# Altium project DSOBoard.PrjPcb
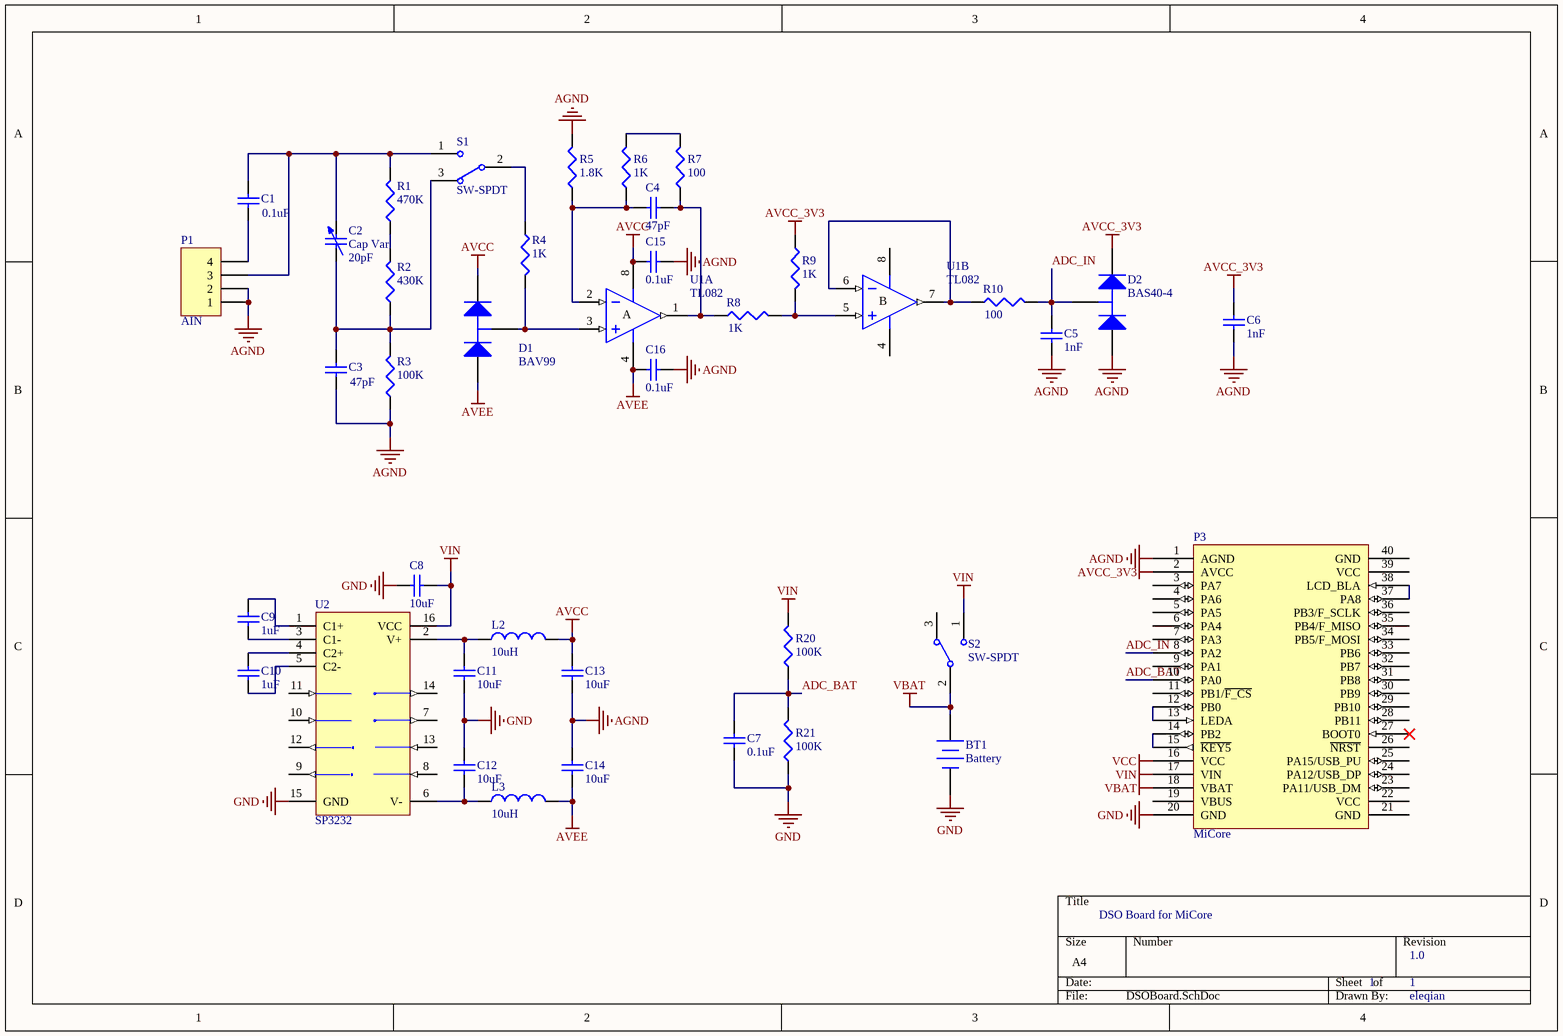
[diagram p0: DSOBoard.SchDoc]
1 sheet, 39 parts. Net scope: global (net labels, ports and power ports of the same name join across sheets).
Board file: DSOBoard.PcbDoc

## Sheet DSOBoard.SchDoc: DSO Board for MiCore
size A4; DrawnBy: eleqian; Revision: 1.0; SheetNumber: 1; SheetTotal: 1

### Parts
BT1  Battery  [BAT-2]
C1  value 0.1uF  [0805C]  (hidden comment: Cap)
C2  Cap Var  value 20pF  [C1210_N]
C3  value 47pF  [0603C]  (hidden comment: Cap)
C4  value 47pF  [0603C]  (hidden comment: Cap)
C5  value 1nF  [0603C]  (hidden comment: Cap)
C6  value 1nF  [0603C]  (hidden comment: Cap)
C7  value 0.1uF  [0603C]  (hidden comment: Cap)
C8  value 10uF  [0603C]  (hidden comment: Cap)
C9  value 1uF  [0603C]  (hidden comment: Cap)
C10  value 1uF  [0603C]  (hidden comment: Cap)
C11  value 10uF  [0603C]  (hidden comment: Cap)
C12  value 10uF  [0603C]  (hidden comment: Cap)
C13  value 10uF  [0603C]  (hidden comment: Cap)
C14  value 10uF  [0603C]  (hidden comment: Cap)
C15  value 0.1uF  [0603C]  (hidden comment: Cap)
C16  value 0.1uF  [0603C]  (hidden comment: Cap)
D1  BAV99  [SOT-23]
D2  BAS40-4  [SOT-23]
L2  value 10uH  [0805L]  (hidden comment: Inductor)
L3  value 10uH  [0805L]  (hidden comment: Inductor)
P1  AIN  [HDR1X4]
P3  MiCore  [MICORE]
R1  value 470K  [0603R]  (hidden comment: Res3)
R2  value 430K  [0603R]  (hidden comment: Res3)
R3  value 100K  [0603R]  (hidden comment: Res3)
R4  value 1K  [0603R]  (hidden comment: Res3)
R5  value 1.8K  [0603R]  (hidden comment: Res3)
R6  value 1K  [0603R]  (hidden comment: Res3)
R7  value 100  [0603R]  (hidden comment: Res3)
R8  value 1K  [0603R]  (hidden comment: Res3)
R9  value 1K  [0603R]  (hidden comment: Res3)
R10  value 100  [0603R]  (hidden comment: Res3)
R20  value 100K  [0603R]  (hidden comment: Res3)
R21  value 100K  [0603R]  (hidden comment: Res3)
S1  SW-SPDT  [SPDT_3S]
S2  SW-SPDT  [SPDT_3S]
U1  TL082  [SO8]  (parts A,B of 2)
U2  SP3232  [NSO16_N]

### Nets
AGND: C3.1 C5.1 C6.1 C13.2 C14.1 C15.1 C16.1 D2.3(A) P1.1 P1.2 P3.1(AGND) R3.1 R5.2
AVCC: C13.1 C15.2 D1.2(K) L2.2 U1.8(V+)
AVCC_3V3: C6.2 D2.2(K) P3.2(AVCC) R9.1
AVEE: C14.2 C16.2 D1.3(A) L3.2 U1.4(V-)
GND: BT1.2(-) C7.1 C8.2 C11.2 C12.2 P3.20(GND) R21.1 U2.15(GND)
VBAT: BT1.1(+) P3.18(VBAT) S2.2
VCC: P3.16(VCC)
VIN: C8.1 P3.17(VIN) R20.2 S2.1 U2.16(VCC)
ADC_BAT: C7.2 P3.10(PA0) R20.1 R21.2
ADC_IN: C5.2 D2.1(C) P3.8(PA2) R10.2
NetC1_1: C1.1 C2.2 P1.3 R1.2 S1.1
NetC1_2: C1.2 P1.4
NetC2_1: C2.1 C3.2 R2.1 R3.2 S1.3
NetC4_1: C4.1 R7.1 R8.1 U1.1(OUT)
NetC4_2: C4.2 R5.1 R6.1 U1.2(IN-)
NetC9_1: C9.1 U2.1(C1+)
NetC9_2: C9.2 U2.3(C1-)
NetC10_1: C10.1 U2.4(C2+)
NetC10_2: C10.2 U2.5(C2-)
NetC11_1: C11.1 L2.1 U2.2(V+)
NetC12_1: C12.1 L3.1 U2.6(V-)
NetD1_1: D1.1(C) R4.2 U1.3(IN+)
NetP3_12: P3.12(PB0) P3.13(LEDA)
NetP3_14: P3.14(PB2) P3.15(~{KEY5})
NetP3_37: P3.37(PA8) P3.38(LCD_BLA)
NetR1_1: R1.1 R2.2
NetR4_1: R4.1 S1.2
NetR6_2: R6.2 R7.2
NetR8_2: R8.2 R9.2 U1.5(IN+)
NetR10_1: R10.1 U1.6(IN-) U1.7(OUT)

Not connected (* = marked no-connect by the designer): P3 3(PA7) 4(PA6) 5(PA5) 6(PA4) 7(PA3) 9(PA1) 11(PB1/~{F_CS}) 19(VBUS) 21(GND) 22(VCC) 23(PA11/USB_DM) 24(PA12/USB_DP) 25(PA15/USB_PU) 26(~{NRST}) 27(BOOT0)* 28(PB11) 29(PB10) 30(PB9) 31(PB8) 32(PB7) 33(PB6) 34(PB5/F_MOSI) 35(PB4/F_MISO) 36(PB3/F_SCLK) 39(VCC) 40(GND); S2 3; U2 7(T2OUT) 8(R2IN) 9(R2OUT) 10(T2IN) 11(T1IN) 12(R1OUT) 13(R1IN) 14(T1OUT)

### Notes on the sheet
- (in symbol AD823AR, part A) A
- (in symbol AD823AR, part B) B

### Library data of the parts
BT1 = Battery: Multicell Battery; Published: 24-Mar-1999; LatestRevisionDate: 17-Jul-2002; LatestRevisionNote: Re-released for DXP Platform.; PackageReference: BAT-2; Publisher: Altium Limited
C1 C3-C16 = Cap: Capacitor
  C1 C8-C12: Published: 8-Jun-2000; LatestRevisionDate: 17-Jul-2002; LatestRevisionNote: Re-released for DXP Platform.; PackageReference: RAD-0.3; Publisher: Altium Limited
  C7 C13-C16: PackageDescription: Radial Cap, Thru-Hole; 2 Leads; 0.3 in Pin Spacing
C2 = Cap Var: Variable or Adjustable Capacitor; Published: 24-Mar-1999; LatestRevisionDate: 29-May-2009; LatestRevisionNote: IPC-7351 Footprint Added.; PackageReference: C1210; Publisher: Altium Limited; PackageDescription: Chip Capacitor 1210 Case Size; Code_JEITA: 1210; Code_IPC: CAPC3225
D1 D2 = BAV99: SOT23 Silicon Planar High-Speed Switching Series Diode Pair; Published: 8-Jun-2000; LatestRevisionDate: 17-Jul-2002; LatestRevisionNote: Re-released for DXP Platform.; DatasheetVersion: May-1995; PackageVersion: 1996; PackageReference: SOT23; Publisher: Altium Limited; PackageDescription: SOT-23; 3 Leads; Body 3.1 x 2.5 mm, inc. leads (LxW max), Alternate Lead Configuration; ComponentLink1Description: Manufacturer Link; ComponentLink1URL: http://www.zetex.com/; ComponentLink2Description: Datasheet; ComponentLink2URL: www.zetex.com/3.0/pdf/BAV99A.pdf
L2 L3 = Inductor: Code_IEC: 1005; Published: 8-Jun-2000; LatestRevisionDate: 29-May-2009; LatestRevisionNote: IPC-7351 Footprint Added.; PackageReference: 0402-A; Publisher: Altium Limited; PackageDescription: Chip Inductor; Code_JEITA: 0402
P1 = Header 4: Header, 4-Pin; LatestRevisionDate: 17-Jul-2002; LatestRevisionNote: Re-released for DXP Platform.; Publisher: Altium Limited
P3 = MiCore: MiCore核心板
R1-R10 R20 R21 = Res3: Resistor; Published: 8-Jun-2000; LatestRevisionDate: 29-May-2009; LatestRevisionNote: IPC-7351 Footprint Added.; PackageReference: J1-0603; Publisher: Altium Limited; PackageDescription: Chip Resistor
S1 S2 = SW-SPDT: SPDT Subminiature Toggle Switch, Right Angle Mounting, Vertical Actuation; Published: 24-Mar-1999; LatestRevisionDate: 17-Dec-2003; LatestRevisionNote: Schematic revised, PCB Footprint replaced.; DatasheetVersion: 05-Dec-2000; PackageReference: TL36WW15050; Publisher: Altium Limited; ComponentLink1Description: Manufacturer Link; ComponentLink1URL: http://www.apem.com
U1 = AD823AR: Dual, 16MHz, Rail-to-Rail FET-Input Amplifier; Published: 8-Jun-2000; LatestRevisionDate: 13-Apr-2006; LatestRevisionNote: IPC-7351 Footprint Added.; DatasheetVersion: REV. 0 1995; PackageVersion: revA; PackageReference: SO-8; Publisher: Altium Limited; PackageDescription: 8-Pin Small Outline Integrated Circuit 1.27 mm Pitch; Code_JEDEC: MS-012-AA; Code_IPC: SOIC127P600-8; ComponentLink1Description: Manufacturer Link; ComponentLink1URL: http://www.analog.com/en/prod/0,,759_786_AD823%2C00.html; ComponentLink2Description: Datasheet; ComponentLink2URL: http://www.analog.com/UploadedFiles/Data_Sheets/560004121AD823_a.pdf
U2 = MAX3232CSE: 3.0V TO 5.5V, Low-Power, up to 1Mbps, True RS-232 Transceiver Using Four 0.1µF External Capacitor; Published: 16-Jan-2001; LatestRevisionDate: 13-Apr-2006; LatestRevisionNote: IPC-7351 Footprint Added.; DatasheetVersion: Mar-1999; PackageReference: NSO16; Publisher: Altium Limited; PackageDescription: 16-Pin Small Outline Integrated Circuit 1.27 mm Pitch; Code_JEDEC: MS-012-AC; Code_IPC: SOIC127P600-16; ComponentLink1Description: Manufacturer Link; ComponentLink1URL: http://www.maxim-ic.com/; ComponentLink2Description: Datasheet; ComponentLink2URL: http://pdfserv.maxim-ic.com/en/ds/MAX3222-MAX3241.pdf